# EasyEDA Pro project CyberryPotter-6050-v4.0.eprj, board PCB_RF_433
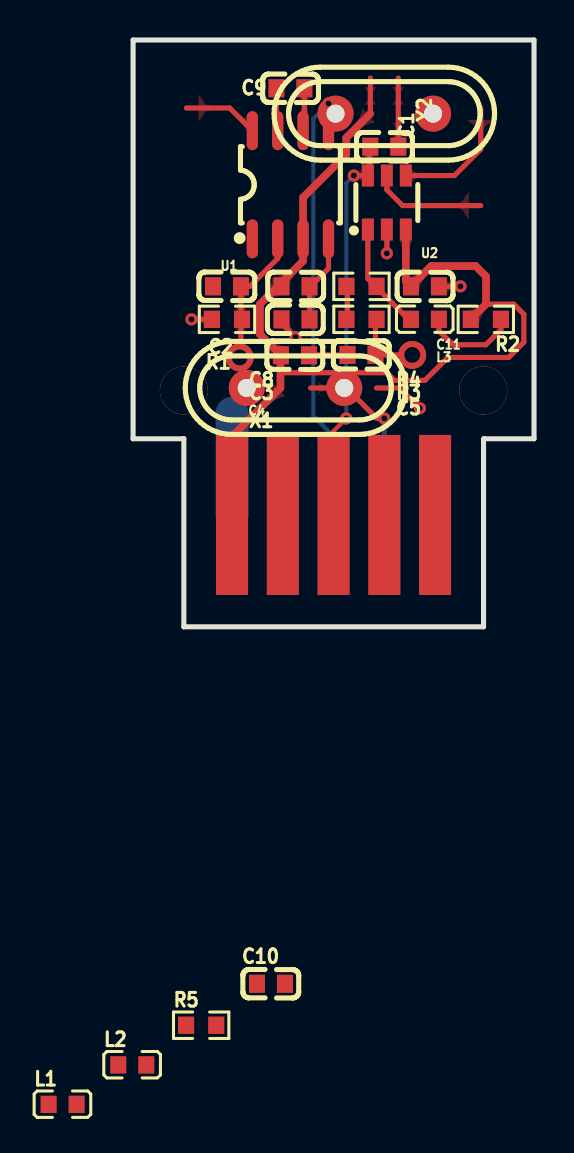
[diagram p6: board, top side]
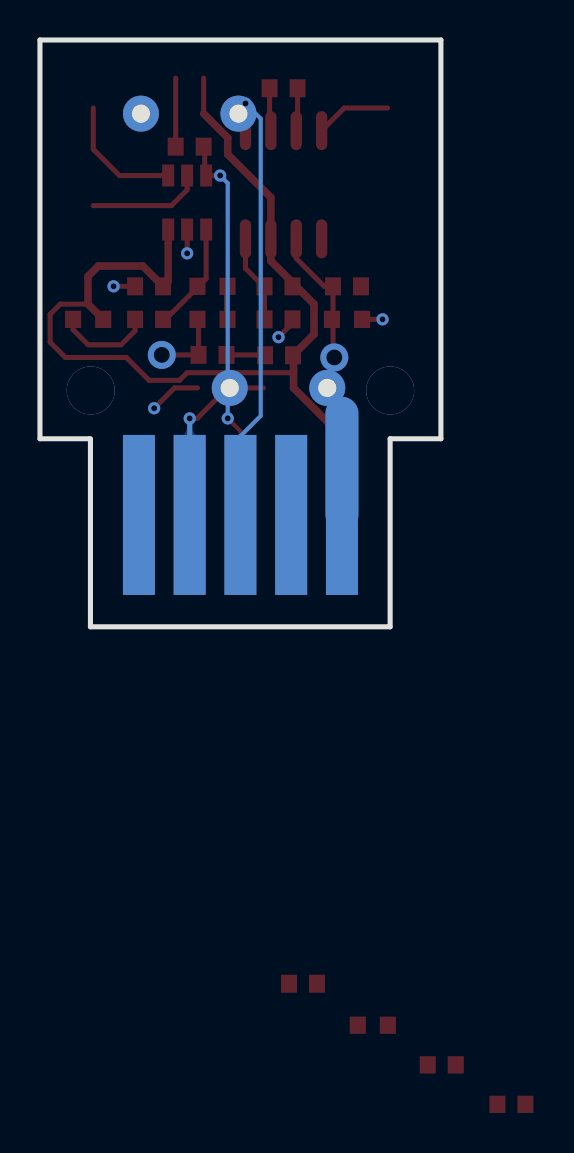
[diagram p7: board, bottom side, seen from below]

Outline 20.07 x 29.34 mm; copper layers: Top Layer, Bottom Layer. Coordinates in mm from the lower left corner of the outline.
Outline path: 0,29.34 0,9.4 2.54,9.4 2.54,0 17.54,0 17.54,9.38 17.56,9.4 20.07,9.4 20.07,29.34 0,29.34
Stack: Top Layer 0.035mm / Dielectric1 1.51mm FR4 er 4.5 / Bottom Layer 0.035mm

## Design rules (mm)
template: JLCPCB Capability(Two Layers Board)
spacing copperThickness1oz (default): track to track 0.102, other pairs 0.152 to 0.3
spacing copperThickness2oz: track to track 0.203, other pairs 0.152 to 0.3
track width copperThickness1oz (default): min 0.127, default 0.254, max 2.54
track width copperThickness2oz: min 0.203, default 0.254, max 2.54
differential pair differentialPair (default): width min 0.127, default 0.254, max 2.54; gap min 0.152, default 0.152
via viaSize (default): diameter min 0.5, default 0.61, max 10; hole min 0.3, default 0.305, max 6.3

## Placement (name value [footprint] x y rotation side)
C1  4.7uF 0603  [C0603]  12.57 24.01 180 top
C2  2.2uF 0603  [C0603]  4.7 17.02 0 top
C3  8.2pF 0603  [C0603]  8.13 15.37 0 top
C4  4.7uF 0603  [C0603]  8.1 13.58 0 top
C5  10pF 0603  [C0603]  11.43 13.59 0 top
C8  10uF 0603  [C0603]  8.13 17.02 180 top
C9  4.7pF 0603  [C0603]  7.87 26.93 180 top
C10  10uF 0603  [C0603]  6.9 -17.85 0 top
C11  0.1uF 0603  [C0603]  14.6 17.02 180 top
L1  18nH 0603  [L0603]  -3.53 -23.88 0 top
L2  82nH 0603  [L0603]  -0.04 -21.91 0 top
L3  680nH 0603  [L0603]  14.6 15.37 0 top
NOREF  -  [Pad_e1284]  12.57 5.59 0 top
NOREF#2  -  [Pad_e1397]  10.03 5.59 0 top
NOREF#3  -  [Pad_e1395]  7.49 5.59 0 top
NOREF#4  -  [Pad_e1396]  7.49 5.59 0 top
NOREF#5  -  [Pad_e1282]  15.11 5.59 0 top
NOREF#6  -  [Pad_e1393]  4.95 5.59 0 top
NOREF#7  -  [Pad_e1392]  4.95 5.59 0 top
NOREF#8  -  [Pad_e1419]  12.57 5.59 0 top
NOREF#9  -  [Pad_e1283]  15.11 5.59 0 top
NOREF#10  -  [Pad_e1394]  10.03 5.59 0 top
R1  820kΩ 0603  [R0603]  4.7 15.37 0 top
R2  180kΩ 0603  [R0603]  17.65 15.37 0 top
R3  1MΩ 0603  [R0603]  11.43 15.37 180 top
R4  100KΩ 0603  [R0603]  11.43 17.02 0 top
R5  0Ω 0603  [R0603]  3.41 -19.92 0 top
U1  SYN480R  [SOIC-8_L5.0-W4.0-P1.27-LS6.0-BL]  7.87 22.1 0 top
U2  F115  [SOT-23-6_L2.9-W1.6-P0.95-LS2.8-BR]  12.7 21.22 270 top
X1  6.7458MHz  [HC-49S_L11.0-W4.7-P4.88]  8.13 11.94 180 top
X2  13.56MHz  [HC-49S_L11.0-W4.7-P4.88]  12.57 25.66 180 top

## Footprints (pads in the part's own frame, mm; a bottom-side part is the same pattern mirrored in y, then rotated)
C0603
  rect 0.8x0.9 smd: 1(-0.7,0) 2(0.7,0)
HC-49S_L11.0-W4.7-P4.88
  round 1.8 hole 0.9: 1(-2.44,0) 2(2.44,0)
L0603
  rect 0.8x0.864 smd: 1(-0.7,0) 2(0.7,0)
Pad_e1282
  rect 1.6x8 smd: 4(0,0)
Pad_e1283
  rect 1.6x8 smd far side: 4(0,0)
Pad_e1284
  rect 1.6x8 smd: 4(0,0)
Pad_e1392
  rect 1.6x8 smd: 4(0,0)
Pad_e1393
  rect 1.6x8 smd far side: 4(0,0)
Pad_e1394
  rect 1.6x8 smd far side: 4(0,0)
Pad_e1395
  rect 1.6x8 smd far side: 4(0,0)
Pad_e1396
  rect 1.6x8 smd: 4(0,0)
Pad_e1397
  rect 1.6x8 smd: 4(0,0)
Pad_e1419
  rect 1.6x8 smd far side: 4(0,0)
R0603
  rect 0.806x0.864 smd: 1(-0.753,0) 2(0.753,0)
SOIC-8_L5.0-W4.0-P1.27-LS6.0-BL
  oval 0.569x1.95 smd: 1(-1.905,-2.705) 2(-0.635,-2.705) 3(0.635,-2.705) 4(1.905,-2.705) 5(1.905,2.705) 6(0.635,2.705) 7(-0.635,2.705) 8(-1.905,2.705)
SOT-23-6_L2.9-W1.6-P0.95-LS2.8-BR
  rect 1.1x0.6 smd: 1(1.35,-0.95) 2(1.35,0) 3(1.35,0.95) 4(-1.35,0.95) 5(-1.35,0) 6(-1.35,-0.95)

## Nets
3V3: C1.1 C8.2 C10.2 C11.2 NOREF#7.4 R1.2 R3.2 R5.1 U1.3 U2.3
GND: C1.2 C2.1 C3.1 C4.1 C8.1 C9.1 L1.1 NOREF#6.4 R2.1 U1.1 U1.6 U2.2 X1.2
ANT1: C3.2 L1.2 U1.2
ANT2: C9.2 L2.1
PA4: NOREF#4.4
PA5: NOREF#3.4
PA6: NOREF#2.4 R4.2 U2.6
PA7: NOREF#10.4 U1.5
PB0: NOREF#9.4
PB1: NOREF#8.4 R1.1 R2.2
PB10: NOREF.4
PB11: NOREF#5.4
$1N8689: C2.2 R3.1 U1.4
$1N8696: U1.8 X1.1
$1N8697: C4.2 U1.7
$1N8701: C5.2 L3.1 U2.1
$1N8702: C5.1 L2.2
$1N8713: C10.1 C11.1 R4.1
$1N8715: L3.2 R5.2
$1N8716: U2.5 X2.2
$1N8718: U2.4 X2.1

## Via types
v1: diameter 2.4, hole 2.4, Top Layer to Bottom Layer, 2 vias
v2: diameter 1.4, hole 0.8, Top Layer to Bottom Layer, 2 vias
v3: diameter 0.61, hole 0.305, Top Layer to Bottom Layer, 9 vias

## Routing (per net, layer and track width the routed paths; a pad name or vN(x,y) marks a point on that pad's centre or on a via; arc(x,y) is an arc through that point)
3V3: length 52.2
  Top Layer w0.254: 17.66,16.14 19.05,16.14 19.56,15.63 19.56,14.23 18.8,13.47 15.75,13.47 14.6,12.33 13.08,12.33 12.7,12.71 7.51,12.71 7.37,12.84 ; 7.24,17.02 7.37,17.02 ; 11.87,25.66 11.87,27.44
  Top Layer w0.381: U2.3 13.65,17.28 C11.2 14.92,18.04 17.14,18.04 17.66,17.52 17.66,16.13 16.9,15.37 ; NOREF#7.4 4.95,9.52 7.37,11.94 7.37,13.55 7.4,13.58 6.35,14.63 6.35,16.14 8.51,18.29 U1.3 8.51,21.47 10.67,23.63 10.67,24.45 11.87,25.66
GND: length 16.3
  Top Layer w0.254: C9.1 8.57,24.87 U1.6 ; v3(8.13,14.48) 7.43,15.18 C3.1 ; 8.8,13.58 8.82,13.59 10.73,13.59 ; v3(14.35,10.93) 13.33,11.94 12.18,11.94 ; U2.2 v3(12.7,18.67) ; v3(16.38,17.02) 15.3,17.02 ; 4,15.37 v3(2.92,15.37)
  Bottom Layer w1.651: NOREF#6.4 4.95,10.67
(no net):
  vias: v1(2.54,11.82) v1(17.53,11.82)
ANT1: length 7
  Top Layer w0.254: v2(5.33,13.47) 5.4,13.53 5.4,17.02 5.84,17.02 7.24,18.42 U1.2
PA6: length 19.6
  Top Layer w0.203: NOREF#2.4 10.03,9.78 v3(10.67,10.42)
  Top Layer w0.254: v3(11.05,22.56) U2.6 11.82,22.63 11.82,24.01
  Bottom Layer w0.203: v3(11.05,22.56) 10.67,22.18 v3(10.67,10.42)
PA7: length 22.7
  Top Layer w0.254: 9.78,26.17 U1.5
  Bottom Layer w0.203: NOREF#10.4 10.03,9.53 9.02,10.55 9.02,25.41 9.78,26.17
PB1: length 9.1
  Top Layer w0.254: v3(12.57,10.42) 12.2,10.42 10.68,11.94 8.88,11.94
  Bottom Layer w0.254: v3(12.57,10.42) NOREF#8.4
$1N1101: length 3.8
  Top Layer w0.254: 5.97,24.81 4.84,25.94 2.67,25.94
$1N5426: length 3.5
  Top Layer w0.254: 13.33,24.01 13.27,24.06 13.27,27.44
$1N7729: length 5.7
  Top Layer w0.254: 17.4,21.06 13.49,21.06 12.7,21.85 12.7,22.56
$1N7737: length 6.4
  Top Layer w0.254: 17.4,25.94 17.4,23.88 16.08,22.56 13.65,22.56
$1N8689: length 4.4
  Top Layer w0.254: 8.83,15.37 8.83,16.97 9.78,17.92 U1.4
$1N8697: length 2.1
  Top Layer w0.254: 7.17,26.93 7.17,24.87 U1.7
$1N8701: length 9.1
  Top Layer w0.254: v2(13.97,13.59) C5.2 12.13,15.37 ; L3.1 13.78,15.37 11.75,17.4 U2.1
$1N8713: length 1.7
  Top Layer w0.254: 10.73,15.37 10.73,17.02
$1N8715: length 4.8
  Top Layer w0.254: L3.2 15.3,14.8 16,14.1 17.65,14.1 18.41,14.86 18.41,15.37
$1N8716:
  vias: v3(9.78,26.17)

## Copper pours and planes (outline as drawn; the poured copper is in the pictures)
GND on Top Layer: 0,29.34 20.07,29.34 20.07,9.4 0,9.4
GND on Bottom Layer: 16.58,20.24 16.24,21.06 16.58,21.88 17.4,22.22 18.22,21.88 18.56,21.06 18.22,20.24 17.4,19.9
GND on Bottom Layer: 16.58,26.76 17.4,27.1 18.22,26.76 18.56,25.94 18.22,25.12 17.4,24.78 16.58,25.12 16.24,25.94
GND on Bottom Layer: 4.66,12.79 4.38,13.47 4.66,14.14 5.33,14.42 6.01,14.14 6.29,13.47 6.01,12.79 5.33,12.51
GND on Bottom Layer: -0.13,29.08 19.94,29.08 19.94,9.02 -0.13,9.02
GND on Bottom Layer: 16.5,12.85 17.53,13.27 18.56,12.85 18.98,11.82 18.56,10.79 17.53,10.36 16.5,10.79 16.07,11.82
GND on Bottom Layer: 1.85,20.24 1.51,21.06 1.85,21.88 2.67,22.22 3.48,21.88 3.82,21.06 3.48,20.24 2.67,19.9
GND on Bottom Layer: 1.85,26.76 2.67,27.1 3.48,26.76 3.82,25.94 3.48,25.12 2.67,24.78 1.85,25.12 1.51,25.94
GND on Bottom Layer: 1.51,12.85 2.54,13.27 3.57,12.85 4,11.82 3.57,10.79 2.54,10.36 1.51,10.79 1.08,11.82
GND on Bottom Layer: outline of 155 points within 0.26,9.4 19.81,29.09
GND on Bottom Layer: 10.28,11.15 10.43,11.37 10.44,11.41 10.44,22.31 10.45,22.4 10.49,22.5 10.49,22.56 10.65,22.96 11.05,23.13 11.45,22.96 11.61,22.56 11.5,22.24 11.17,21.99 11.15,21.93 11.15,11.41 11.16,11.37 11.31,11.15 11.36,10.93 11.19,10.53 10.79,10.37 10.4,10.53 10.23,10.93

Small or netless copper shapes (teardrops, artwork), in the pictures only: 49 on Top Layer, 5 on Bottom Layer
